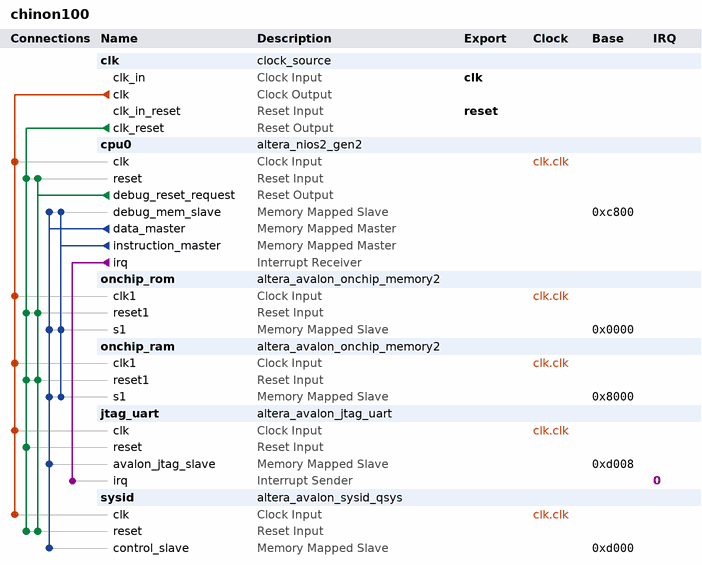
[diagram p0: system contents]
# Platform Designer (Qsys) system chinon100, Cyclone IV E EP4CE6F17C8
# Parameters at their usual value, and those the tool derives, are not listed.
package require -exact qsys 18.0
create_system chinon100
set_project_property DEVICE_FAMILY {Cyclone IV E}
set_project_property DEVICE EP4CE6F17C8

add_instance clk clock_source 18.0
set_instance_parameter_value clk clockFrequency 50000000

add_instance cpu0 altera_nios2_gen2 18.0
set_instance_parameter_value cpu0 dcache_size 2048
set_instance_parameter_value cpu0 exceptionSlave onchip_ram.s1
set_instance_parameter_value cpu0 icache_size 4096
set_instance_parameter_value cpu0 impl Tiny
set_instance_parameter_value cpu0 resetSlave onchip_rom.s1

add_instance onchip_rom altera_avalon_onchip_memory2 18.0
set_instance_parameter_value onchip_rom dataWidth 32
set_instance_parameter_value onchip_rom dualPort false
set_instance_parameter_value onchip_rom initMemContent true
set_instance_parameter_value onchip_rom initializationFileName onchip_mem.hex
set_instance_parameter_value onchip_rom memorySize 10240
set_instance_parameter_value onchip_rom writable false

add_instance onchip_ram altera_avalon_onchip_memory2 18.0
set_instance_parameter_value onchip_ram dataWidth 32
set_instance_parameter_value onchip_ram dualPort false
set_instance_parameter_value onchip_ram initMemContent true
set_instance_parameter_value onchip_ram initializationFileName onchip_mem.hex
set_instance_parameter_value onchip_ram memorySize 10240

add_instance jtag_uart altera_avalon_jtag_uart 18.0
set_instance_parameter_value jtag_uart simInteractiveOptions NO_INTERACTIVE_WINDOWS

add_instance sysid altera_avalon_sysid_qsys 18.0
set_instance_parameter_value sysid id 0

# connections
add_connection clk.clk cpu0.clk clock
add_connection clk.clk jtag_uart.clk clock
add_connection clk.clk onchip_ram.clk1 clock
add_connection clk.clk onchip_rom.clk1 clock
add_connection clk.clk sysid.clk clock
add_connection clk.clk_reset cpu0.reset reset
add_connection clk.clk_reset jtag_uart.reset reset
add_connection clk.clk_reset onchip_ram.reset1 reset
add_connection clk.clk_reset onchip_rom.reset1 reset
add_connection clk.clk_reset sysid.reset reset
add_connection cpu0.debug_reset_request cpu0.reset reset
add_connection cpu0.debug_reset_request onchip_ram.reset1 reset
add_connection cpu0.debug_reset_request onchip_rom.reset1 reset
add_connection cpu0.debug_reset_request sysid.reset reset
add_connection cpu0.data_master cpu0.debug_mem_slave avalon
set_connection_parameter_value cpu0.data_master/cpu0.debug_mem_slave baseAddress 0xc800
add_connection cpu0.data_master jtag_uart.avalon_jtag_slave avalon
set_connection_parameter_value cpu0.data_master/jtag_uart.avalon_jtag_slave baseAddress 0xd008
add_connection cpu0.data_master onchip_ram.s1 avalon
set_connection_parameter_value cpu0.data_master/onchip_ram.s1 baseAddress 0x8000
add_connection cpu0.data_master onchip_rom.s1 avalon
set_connection_parameter_value cpu0.data_master/onchip_rom.s1 baseAddress 0x0000
add_connection cpu0.data_master sysid.control_slave avalon
set_connection_parameter_value cpu0.data_master/sysid.control_slave baseAddress 0xd000
add_connection cpu0.instruction_master cpu0.debug_mem_slave avalon
set_connection_parameter_value cpu0.instruction_master/cpu0.debug_mem_slave baseAddress 0xc800
add_connection cpu0.instruction_master onchip_ram.s1 avalon
set_connection_parameter_value cpu0.instruction_master/onchip_ram.s1 baseAddress 0x8000
add_connection cpu0.instruction_master onchip_rom.s1 avalon
set_connection_parameter_value cpu0.instruction_master/onchip_rom.s1 baseAddress 0x0000
add_connection cpu0.irq jtag_uart.irq interrupt
set_connection_parameter_value cpu0.irq/jtag_uart.irq irqNumber 0

# exported interfaces
add_interface clk clock sink
set_interface_property clk EXPORT_OF clk.clk_in
add_interface reset reset sink
set_interface_property reset EXPORT_OF clk.clk_in_reset

set_interconnect_requirement {$system} qsys_mm.clockCrossingAdapter HANDSHAKE
set_interconnect_requirement {$system} qsys_mm.enableEccProtection FALSE
set_interconnect_requirement {$system} qsys_mm.insertDefaultSlave FALSE
set_interconnect_requirement {$system} qsys_mm.maxAdditionalLatency 1

save_system chinon100.qsys
